# Altium project ACTUALFINALECU.PrjPcb
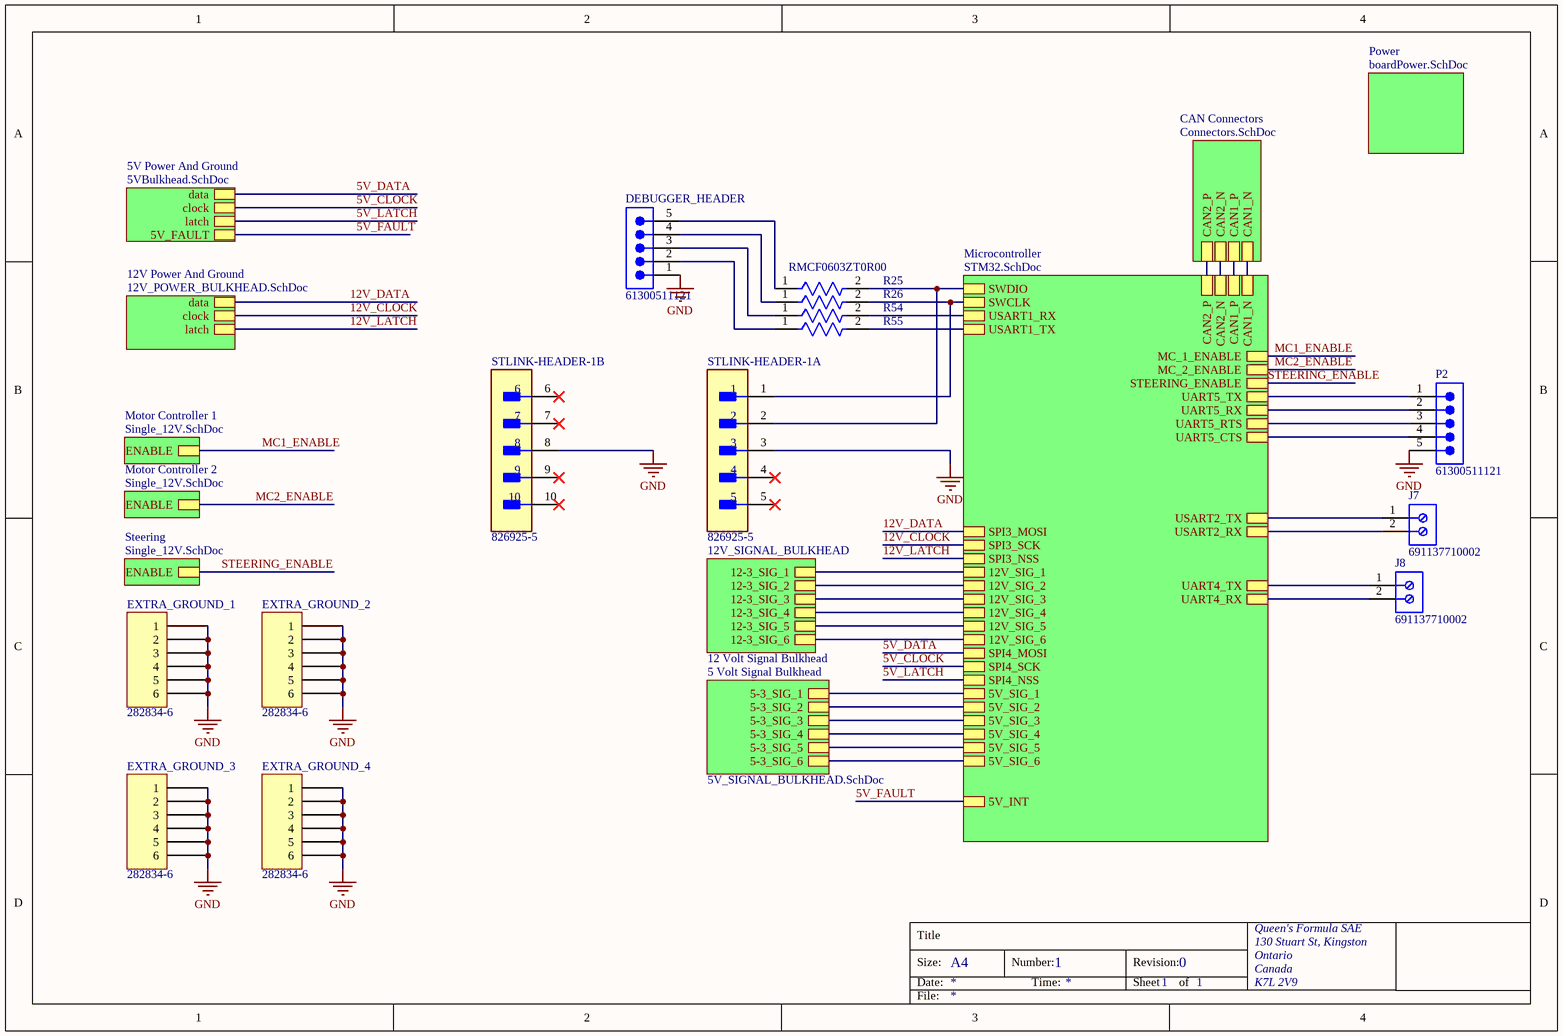
[diagram p0: TOP.SchDoc]
4 sheets, 47 parts. Net scope: hierarchical (ports join the sheet entries above them; power ports are global).
Board file: PCB.PcbDoc
Sheets:
  TOP.SchDoc
    Power = boardPower.SchDoc
    5 Volt Signal Bulkhead = 5V_SIGNAL_BULKHEAD.SchDoc
  CAN.SchDoc

## Sheet TOP.SchDoc: =DocumentName
size A4; Organization: Queen's Formula SAE; Address1: 130 Stuart St, Kingston; Address2: Ontario; Address3: Canada; Address4: K7L 2V9; DocumentNumber: 1; Revision: 0; SheetNumber: 1; SheetTotal: 1

### Parts
DEBUGGER_HEADER  61300511121  [61300511121]
EXTRA_GROUND_1  282834-6  [TE 282834-6]
EXTRA_GROUND_2  282834-6  [TE 282834-6]
EXTRA_GROUND_3  282834-6  [TE 282834-6]
EXTRA_GROUND_4  282834-6  [TE 282834-6]
J7  691137710002  [691137710002]
J8  691137710002  [691137710002]
P2  61300511121  [61300511121]
R25  RMCF0603ZT0R00  [FP-RMCF0603-MFG]
R26  RMCF0603ZT0R00  [FP-RMCF0603-MFG]  (value not drawn)
R54  RMCF0603ZT0R00  [FP-RMCF0603-MFG]  (value not drawn)
R55  RMCF0603ZT0R00  [FP-RMCF0603-MFG]  (value not drawn)
STLINK-HEADER-1  826925-5  [FP-826925-5-MFG]  (parts A,B of 2)

### Sub-sheets
5 Volt Signal Bulkhead = 5V_SIGNAL_BULKHEAD.SchDoc: 5-3_SIG_1, 5-3_SIG_2, 5-3_SIG_3, 5-3_SIG_4, 5-3_SIG_5, 5-3_SIG_6
5V Power And Ground = 5VBulkhead.SchDoc (file not in this document): data, clock, latch, 5V_FAULT
12 Volt Signal Bulkhead = 12V_SIGNAL_BULKHEAD (file not in this document): 12-3_SIG_1, 12-3_SIG_2, 12-3_SIG_3, 12-3_SIG_4, 12-3_SIG_5, 12-3_SIG_6
12V Power And Ground = 12V_POWER_BULKHEAD.SchDoc (file not in this document): data, clock, latch
CAN Connectors = Connectors.SchDoc (file not in this document): CAN1_N, CAN1_P, CAN2_N, CAN2_P
Microcontroller = STM32.SchDoc (file not in this document): SWDIO, SWCLK, USART1_RX, USART1_TX, SPI3_NSS, SPI3_MOSI, SPI3_SCK, CAN1_P, CAN1_N, CAN2_N, CAN2_P, 12V_SIG_1, MC_1_ENABLE, MC_2_ENABLE, STEERING_ENABLE, 12V_SIG_2, 12V_SIG_4, 12V_SIG_3, 12V_SIG_5, 12V_SIG_6, SPI4_NSS, SPI4_MOSI, SPI4_SCK, 5V_SIG_1, 5V_SIG_2, 5V_SIG_3, 5V_SIG_5, 5V_SIG_4, 5V_SIG_6, UART5_TX, UART5_RX, UART5_RTS, UART5_CTS, 5V_INT, USART2_TX, USART2_RX, UART4_TX, UART4_RX
Motor Controller 1 = Single_12V.SchDoc (file not in this document): ENABLE
Motor Controller 2 = Single_12V.SchDoc (file not in this document): ENABLE
Power = boardPower.SchDoc: no entries
Steering = Single_12V.SchDoc (file not in this document): ENABLE

### Nets
GND: DEBUGGER_HEADER.1 EXTRA_GROUND_1.1 EXTRA_GROUND_1.2 EXTRA_GROUND_1.3 EXTRA_GROUND_1.4 EXTRA_GROUND_1.5 EXTRA_GROUND_1.6 EXTRA_GROUND_2.1 EXTRA_GROUND_2.2 EXTRA_GROUND_2.3 EXTRA_GROUND_2.4 EXTRA_GROUND_2.5 EXTRA_GROUND_2.6 EXTRA_GROUND_3.1 EXTRA_GROUND_3.2 EXTRA_GROUND_3.3 EXTRA_GROUND_3.4 EXTRA_GROUND_3.5 EXTRA_GROUND_3.6 EXTRA_GROUND_4.1 EXTRA_GROUND_4.2 EXTRA_GROUND_4.3 EXTRA_GROUND_4.4 EXTRA_GROUND_4.5 EXTRA_GROUND_4.6 P2.5 STLINK-HEADER-1.3 STLINK-HEADER-1.8
5V_CLOCK: sheet Microcontroller/SPI4_SCK, sheet 5V Power And Ground/clock
5V_DATA: sheet Microcontroller/SPI4_MOSI, sheet 5V Power And Ground/data
5V_FAULT: sheet Microcontroller/5V_INT, sheet 5V Power And Ground/5V_FAULT
5V_LATCH: sheet Microcontroller/SPI4_NSS, sheet 5V Power And Ground/latch
12V_CLOCK: sheet Microcontroller/SPI3_SCK, sheet 12V Power And Ground/clock
12V_DATA: sheet Microcontroller/SPI3_MOSI, sheet 12V Power And Ground/data
12V_LATCH: sheet Microcontroller/SPI3_NSS, sheet 12V Power And Ground/latch
MC1_ENABLE: sheet Microcontroller/MC_1_ENABLE, sheet Motor Controller 1/ENABLE
MC2_ENABLE: sheet Microcontroller/MC_2_ENABLE, sheet Motor Controller 2/ENABLE
STEERING_ENABLE: sheet Microcontroller/STEERING_ENABLE, sheet Steering/ENABLE
NetDEBUGGER_HEADER_2: DEBUGGER_HEADER.2 R55.1
NetDEBUGGER_HEADER_3: DEBUGGER_HEADER.3 R54.1
NetDEBUGGER_HEADER_4: DEBUGGER_HEADER.4 R26.1
NetDEBUGGER_HEADER_5: DEBUGGER_HEADER.5 R25.1
NetJ7_1: J7.1 ; sheet Microcontroller/USART2_TX
NetJ7_2: J7.2 ; sheet Microcontroller/USART2_RX
NetJ8_1: J8.1 ; sheet Microcontroller/UART4_TX
NetJ8_2: J8.2 ; sheet Microcontroller/UART4_RX
NetP2_1: P2.1 ; sheet Microcontroller/UART5_TX
NetP2_2: P2.2 ; sheet Microcontroller/UART5_RX
NetP2_3: P2.3 ; sheet Microcontroller/UART5_RTS
NetP2_4: P2.4 ; sheet Microcontroller/UART5_CTS
NetR25_2: R25.2 STLINK-HEADER-1.2 ; sheet Microcontroller/SWDIO
NetR26_2: R26.2 STLINK-HEADER-1.1 ; sheet Microcontroller/SWCLK
NetR54_2: R54.2 ; sheet Microcontroller/USART1_RX
NetR55_2: R55.2 ; sheet Microcontroller/USART1_TX
(unnamed): sheet Microcontroller/CAN1_P, sheet CAN Connectors/CAN1_P
(unnamed): sheet Microcontroller/CAN1_N, sheet CAN Connectors/CAN1_N
(unnamed): sheet Microcontroller/CAN2_N, sheet CAN Connectors/CAN2_N
(unnamed): sheet Microcontroller/CAN2_P, sheet CAN Connectors/CAN2_P
(unnamed): sheet Microcontroller/12V_SIG_1, sheet 12 Volt Signal Bulkhead/12-3_SIG_1
(unnamed): sheet Microcontroller/12V_SIG_2, sheet 12 Volt Signal Bulkhead/12-3_SIG_2
(unnamed): sheet Microcontroller/12V_SIG_4, sheet 12 Volt Signal Bulkhead/12-3_SIG_4
(unnamed): sheet Microcontroller/12V_SIG_3, sheet 12 Volt Signal Bulkhead/12-3_SIG_3
(unnamed): sheet Microcontroller/12V_SIG_5, sheet 12 Volt Signal Bulkhead/12-3_SIG_5
(unnamed): sheet Microcontroller/12V_SIG_6, sheet 12 Volt Signal Bulkhead/12-3_SIG_6
(unnamed): sheet Microcontroller/5V_SIG_1, sheet 5 Volt Signal Bulkhead/5-3_SIG_1
(unnamed): sheet Microcontroller/5V_SIG_2, sheet 5 Volt Signal Bulkhead/5-3_SIG_2
(unnamed): sheet Microcontroller/5V_SIG_3, sheet 5 Volt Signal Bulkhead/5-3_SIG_3
(unnamed): sheet Microcontroller/5V_SIG_5, sheet 5 Volt Signal Bulkhead/5-3_SIG_5
(unnamed): sheet Microcontroller/5V_SIG_4, sheet 5 Volt Signal Bulkhead/5-3_SIG_4
(unnamed): sheet Microcontroller/5V_SIG_6, sheet 5 Volt Signal Bulkhead/5-3_SIG_6

Not connected (* = marked no-connect by the designer): STLINK-HEADER-1 4* 5* 6* 7* 9* 10*

### Notes on the sheet
- Title
- Size:
- Date:
- A4
- Number:
- Time:
- Revision:
- Sheet
- of
- File:

### Library data of the parts
DEBUGGER_HEADER P2 = CMP-1502-01068-2: NexarPartId: 32855526; Operating Supply Voltage: 250V; Number of Contacts: 5; Connector Type: Male Pin; Current Rating: 3A; Contact Resistance: 20mΩ; Pitch: 2.54mm; Gender: Male; Termination: Solder; RoHS: Compliant; Lead Pitch: 2.54mm; Contact Mating Length: 5.9944mm; Number of Positions: 5; Lead Free: Lead Free; Contact Plating: Gold; Number of Pins: 5; Min Operating Temperature: -40°C; Voltage Rating: 250V; Color: Black; Mount: Through Hole; REACH SVHC: Unknown; Packaging: Bulk; Height: 8.89mm; Number of Rows: 1; Orientation: Vertical; Contact Material: Copper; Max Operating Temperature: 105°C
EXTRA_GROUND_1-EXTRA_GROUND_4 = 282834-6: TERM BLK 6P SIDE ENT 2.54MM PCB; Manufacturer: TE Connectivity AMP Connectors; Current: 10A; Mating Orientation: Horizontal with Board; Number of Levels: 1; Pitch: 0.100" (2.54mm); Positions Per Level: 6; Voltage: 150V; Wire Gauge: 16-30 AWG; Wire Termination: Screw - Rising Cage Clamp; Part Number: 282834-6; Color: Green; ComponentLink1Description: Datasheet; ComponentLink1URL: https://www.te.com/commerce/DocumentDelivery/DDEController?Action=srchrtrv&DocNm=282834&DocType=Customer+Drawing&DocLang=English; ComponentLink2Description: DigiKey Link; ComponentLink2URL: http://digikey.com/product-detail/en/te-connectivity-amp-connectors/282834-6/A98337-ND/1153267; LastUpdated: 2020-01-15 4:16:31 AM; Lifecycle Status: Active; Minimum Order: 1; Mounting Type: Through Hole; Packaging: Bulk; Part Status: Active; Price: 4.72; Series: Buchanan; Supplier 1: DigiKey; Supplier Part Number 1: A98337-ND
J7 J8 = CMP-1502-03324-2: NexarPartId: 78871135; Voltage Rating: 300V; Number of Contacts: 2; Current Rating: 16A; Lead Pitch: 5mm; Height: 11.6mm; Packaging: Box; RoHS: Non-Compliant; Contact Material: Nickel, Tin; Max Operating Temperature: 120°C; Number of Pins: 2; Min Operating Temperature: -30°C; Number of Rows: 1
R25 R26 R54 R55 = CMP-26527-000011-1: RES 0 OHM JUMPER 1/10W 0603; Manufacturer: Stackpole; Power Rating: 0.1W; Voltage Rating: 75V; Resistance: 0mΩ; Automotive Grade: Grade 0; Value: 0mΩ; Series: RMCF; Manufacturer Part Number: RMCF0603ZT0R00; Device Class L1: Passive Components; Device Class L3: Chip SMD Resistors; Octopart: https://octopart.com/rmcf0603zt0r00-stackpole+electronics-19213618; Temperature: -55°C to +155°C; Lead Free: Yes; ComponentLink2URL: https://www.seielect.com/catalog/sei-rmcf_rmcp.pdf; Height: 0.55mm; Composition: Thick Film; Package: RMCF0603; Automotive: Yes; Temperature Range High: +155°C; Ipc Land Pattern Name: RESC15580X45; Digikey Description: RES 0 OHM JUMPER 1/10W 0603; RoHS: TRUE; ComponentLink2Description: Datasheet; Temperature Range Low: -55°C; Category: Res; Device Class L2: Resistors
STLINK-HEADER-1 = CMP-03369-000006-1: CONN HEADER VERT 10POS 2.54MM; Manufacturer: TE Connectivity; Conn Orientation: Vertical; Standoff Height: 0.3mm; Number Of Contacts: 10; Current Rating: 5A; Conn Gender: Male; Number Of Rows: 2; Category: Conn; Octopart: https://octopart.com/826925-5-te+connectivity-41836231; Lead Free: Yes; Height: 9.9mm; ComponentLink2Description: Datasheet; Temperature Range High: +105°C; Pitch: 2.54mm; Manufacturer Part Number: 826925-5; Automotive: No; Digikey Description: CONN HEADER VERT 10POS 2.54MM; ComponentLink2URL: https://www.te.com/commerce/DocumentDelivery/DDEController?Action=showdoc&DocId=Customer+Drawing%7F826629%7FAC%7Fpdf%7FEnglish%7FENG_CD_826629_AC.pdf%7F826925-5; Temperature: -65°C to +105°C; RoHS: TRUE; Package: 826925-5; Contact Material: Tin,Nickel; Mouser Description: Headers & Wire Housings 2X05 POS VERT TIN; Device Class L2: Headers and Wire Housings; Device Class L3: unset; Device Class L1: Connectors; Temperature Range Low: -65°C

## Sheet boardPower.SchDoc
size A4
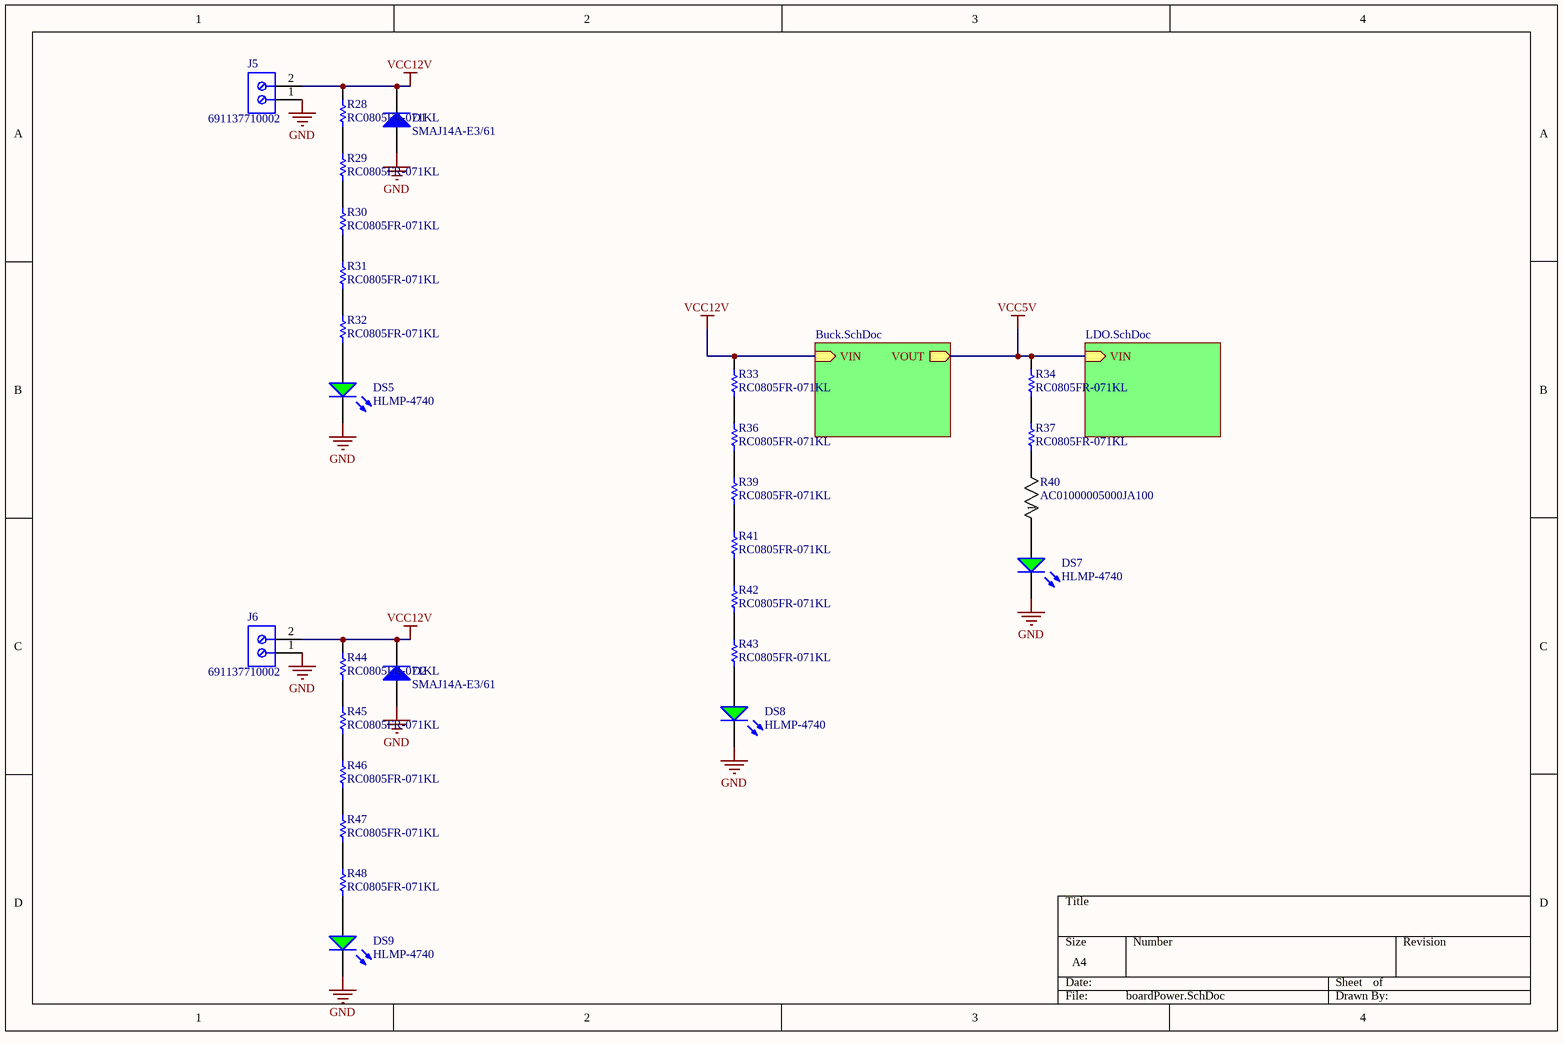
[diagram p1: boardPower.SchDoc]

### Parts
D1  SMAJ14A-E3/61  [VISH-DO-214AC-2_L]
D2  SMAJ14A-E3/61  [VISH-DO-214AC-2_L]
DS5  HLMP-4740  [AVAG-HLMP-4740]
DS7  HLMP-4740  [AVAG-HLMP-4740]
DS8  HLMP-4740  [AVAG-HLMP-4740]
DS9  HLMP-4740  [AVAG-HLMP-4740]
J5  691137710002  [691137710002]
J6  691137710002  [691137710002]
R28  RC0805FR-071KL  [RESC2013X60X35ML10T20]
R29  RC0805FR-071KL  [RESC2013X60X35ML10T20]
R30  RC0805FR-071KL  [RESC2013X60X35ML10T20]
R31  RC0805FR-071KL  [RESC2013X60X35ML10T20]
R32  RC0805FR-071KL  [RESC2013X60X35ML10T20]
R33  RC0805FR-071KL  [RESC2013X60X35ML10T20]
R34  RC0805FR-071KL  [RESC2013X60X35ML10T20]
R36  RC0805FR-071KL  [RESC2013X60X35ML10T20]
R37  RC0805FR-071KL  [RESC2013X60X35ML10T20]
R39  RC0805FR-071KL  [RESC2013X60X35ML10T20]
R40  AC01000005000JA100  [RES_AC01_VIS]
R41  RC0805FR-071KL  [RESC2013X60X35ML10T20]
R42  RC0805FR-071KL  [RESC2013X60X35ML10T20]
R43  RC0805FR-071KL  [RESC2013X60X35ML10T20]
R44  RC0805FR-071KL  [RESC2013X60X35ML10T20]
R45  RC0805FR-071KL  [RESC2013X60X35ML10T20]
R46  RC0805FR-071KL  [RESC2013X60X35ML10T20]
R47  RC0805FR-071KL  [RESC2013X60X35ML10T20]
R48  RC0805FR-071KL  [RESC2013X60X35ML10T20]

### Sub-sheets
Buck = Buck.SchDoc (file not in this document): VIN (in), VOUT (out)
LDO = LDO.SchDoc (file not in this document): VIN (in)

### Nets
GND: D1.2(A) D2.2(A) DS5.2(K) DS7.2(K) DS8.2(K) DS9.2(K) J5.1 J6.1
VCC5V: R34.2 ; sheet Buck/VOUT, sheet LDO/VIN
VCC12V: D1.1(K) D2.1(K) J5.2 J6.2 R28.2 R33.2 R44.2 ; sheet Buck/VIN
NetDS5_1: DS5.1(A) R32.1
NetDS7_1: DS7.1(A) R40.1
NetDS8_1: DS8.1(A) R43.1
NetDS9_1: DS9.1(A) R48.1
NetR28_1: R28.1 R29.2
NetR29_1: R29.1 R30.2
NetR30_1: R30.1 R31.2
NetR31_1: R31.1 R32.2
NetR33_1: R33.1 R36.2
NetR34_1: R34.1 R37.2
NetR36_1: R36.1 R39.2
NetR37_1: R37.1 R40.2
NetR39_1: R39.1 R41.2
NetR41_1: R41.1 R42.2
NetR42_1: R42.1 R43.2
NetR44_1: R44.1 R45.2
NetR45_1: R45.1 R46.2
NetR46_1: R46.1 R47.2
NetR47_1: R47.1 R48.2

### Library data of the parts
D1 D2 = CMP-0548-00224-2: Transient Voltage Suppressor, 6.40 to 231 V, 14 V Stand-off Voltage, Uni-Directional, -55 to 155 degC, 2-pin DO-214AC, Pb-Free, Tape and Reel; Manufacturer: Vishay Semiconductor; PPPM (W): 400, 300; VWM (V): 14; VBR Uni-Directional (V): 6.4 to 231; IFSM: 40 A; ID (uA): 1; PackageDescription: 2-Pin DO-214AC (SMA), Body 4.245 x 2.665 mm; ComponentLink2URL: http://www.vishay.com/docs/88390/smaj50a.pdf; Mounting Technology: Surface Mount; PartNumber: SMAJ14A-E3/61; Operating Junction and Storage Temperature Range: -55 to 150 degC; ComponentLink2Description: Datasheet; Packing: Tape and Reel; PackageReference: DO-214AC-2; ComponentLink3Description: Package Specification; ComponentLink1URL: http://www.vishay.com/; RoHS: TRUE; ComponentLink3URL: http://www.vishay.com/docs/88390/smaj50a.pdf; ComponentLink1Description: Manufacturer URL; DatasheetVersion: 12/8/2013
DS5 DS7-DS9 = CMP-2000-06413-1: T-1 3/4 (5 mm) Low Current LED Lamp, Green, 1.9 V, -20 to 100 degC, 2-Pin THD, RoHS, Bulk; Manufacturer: AvagoTechnologies; Type: Uni-Color; Peak Wavelength: 565nm; Rad Hard: No; Viewing Angle: 50°; Dominant Wavelength/Color Temperature: 569nm; Number of LEDs: 1; Lens Appearance: ColoredDiffused; Lens Shape Type: Circular; Mounting Orientation: TopMount; Intensity: 2.3mcd; Datasheet Version: 07/2014; Category: LEDs; Datasheet URL: http://docs.avagotech.com/docs/AV02-1557EN; Packaging: Bulk; Pin Count: 2; Mounting Technology: ThroughHole; Package Reference: HLMP-4740; Mounting: ThroughHole; Manufacturer URL: http://www.avagotech.com/; Color: Green; Package: 2T-13/4; Package Description: 2-Pin Through Hole Device, Dia 5.845 mm, Pitch 2.54 mm
J5 J6 = CMP-1502-03324-2: as J7 on sheet TOP; Lead Pitch: 5mm; Height: 11.6mm; Packaging: Box; RoHS: Non-Compliant; Contact Material: Nickel, Tin; Max Operating Temperature: 120°C; Number of Pins: 2; Min Operating Temperature: -30°C; Number of Rows: 1
R28-R34 R36 R37 R39 R41-R48 = CMP-2100-03671-1: Chip Resistor, 1 KOhm, +/- 1%, 125 mW, -55 to 155 degC, 0805 (2012 Metric), RoHS, Tape and Reel; Manufacturer: Yageo; Temperature Coefficient: 100ppm/degreesC; Voltage Rating (DC): 150V; Max Power Dissipation: 125mW; Resistance: 1KOhm; Number of Pins: 2; Number of Terminations: 2; Datasheet URL: http://www.yageo.com/NewPortal/yageodocoutput?fileName=/pdf/R-Chip/PYu-RC_Group_51_RoHS_L_5.pdf; Length: 0.079inch; Package Description: 2-Pin Surface Mounted Device, Body 2 x 1.25 mm; Depth: 1.25mm; Height: 0.024inch; Military Standard: Not; Case/Package: 0805; Package Reference: 0805; RoHSCompliant: true; Lead Free: LeadFree; Packaging: TapeandReel; Package Quantity: 1; Datasheet Version: Rev. 5, 10/2016; Tolerance: 1%; Min Operating Temperature: -55degC; Voltage Rating: 150V; Composition: ThickFilm; Case Code (Imperial): 0805; Power Rating: 125mW; Width: 0.049inch; Case Code (Metric): 2012; Manufacturer URL: http://www.yageo.com/; Max Operating Temperature: 155degC; REACH SVHC: Unknown; Termination: SMD/SMT
R40 = CMP-00030-39746512-1: AC01000005000JA100 Res Wirewound 500 Ohm 5% 1W 100ppm/°C to 180ppm/°C Conformal AXL Thru-Hole Ammo Pack; Voltage Rating (DC): 22V; Lead Diameter: 800µm; Resistance: 500Ω; Weight: 519.986953mg; Number of Pins: 2; Min Operating Temperature: -40°C; Case/Package: Axial; Schedule B: 8533210080, 8533210080; Features: Flame Retardant Coating; Power Rating: 1W; Max Power Dissipation: 1W; Packaging: Tape & Box (TB); RoHS: Compliant; REACH SVHC: Unknown; NexarPartId: 39746512; Temperature Coefficient: 180ppm/°C; Diameter: 4.3mm; Contact Plating: Tin; Radiation Hardening: No; Max Operating Temperature: 275°C; Length: 11mm; Tolerance: 5%; Composition: Wirewound; Number of Terminations: 2; Termination: Axial; Voltage Rating: 22V

## Sheet 5V_SIGNAL_BULKHEAD.SchDoc
size A4
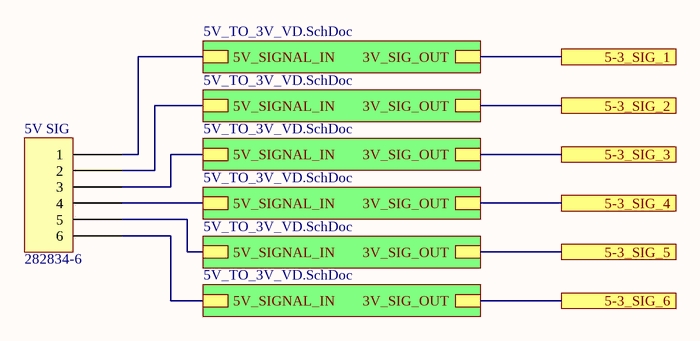
[diagram p2: 5V_SIGNAL_BULKHEAD.SchDoc]

### Parts
5V_SIG  282834-6  [TE 282834-6]

### Sub-sheets
Designator = 5V_TO_3V_VD.SchDoc (file not in this document): 5V_SIGNAL_IN, 3V_SIG_OUT
Designator = 5V_TO_3V_VD.SchDoc (file not in this document): 5V_SIGNAL_IN, 3V_SIG_OUT
Designator = 5V_TO_3V_VD.SchDoc (file not in this document): 5V_SIGNAL_IN, 3V_SIG_OUT
Designator = 5V_TO_3V_VD.SchDoc (file not in this document): 5V_SIGNAL_IN, 3V_SIG_OUT
Designator = 5V_TO_3V_VD.SchDoc (file not in this document): 5V_SIGNAL_IN, 3V_SIG_OUT
Designator = 5V_TO_3V_VD.SchDoc (file not in this document): 5V_SIGNAL_IN, 3V_SIG_OUT

### Ports
5-3_SIG_1, 5-3_SIG_2, 5-3_SIG_3, 5-3_SIG_4, 5-3_SIG_5, 5-3_SIG_6

### Nets
Net5V_SIG_1: 5V_SIG.1 ; sheet Designator/5V_SIGNAL_IN
Net5V_SIG_2: 5V_SIG.2 ; sheet Designator/5V_SIGNAL_IN
Net5V_SIG_3: 5V_SIG.3 ; sheet Designator/5V_SIGNAL_IN
Net5V_SIG_4: 5V_SIG.4 ; sheet Designator/5V_SIGNAL_IN
Net5V_SIG_5: 5V_SIG.5 ; sheet Designator/5V_SIGNAL_IN
Net5V_SIG_6: 5V_SIG.6 ; sheet Designator/5V_SIGNAL_IN
(unnamed): port 5-3_SIG_1, sheet Designator/3V_SIG_OUT
(unnamed): port 5-3_SIG_2, sheet Designator/3V_SIG_OUT
(unnamed): port 5-3_SIG_3, sheet Designator/3V_SIG_OUT
(unnamed): port 5-3_SIG_5, sheet Designator/3V_SIG_OUT
(unnamed): port 5-3_SIG_4, sheet Designator/3V_SIG_OUT
(unnamed): port 5-3_SIG_6, sheet Designator/3V_SIG_OUT

### Library data of the parts
5V_SIG = 282834-6: as EXTRA_GROUND_1 on sheet TOP; Part Number: 282834-6; Color: Green; ComponentLink1Description: Datasheet; ComponentLink1URL: https://www.te.com/commerce/DocumentDelivery/DDEController?Action=srchrtrv&DocNm=282834&DocType=Customer+Drawing&DocLang=English; ComponentLink2Description: DigiKey Link; ComponentLink2URL: http://digikey.com/product-detail/en/te-connectivity-amp-connectors/282834-6/A98337-ND/1153267; LastUpdated: 2020-01-15 4:16:31 AM; Lifecycle Status: Active; Minimum Order: 1; Mounting Type: Through Hole; Packaging: Bulk; Part Status: Active; Price: 4.72; Series: Buchanan; Supplier 1: DigiKey; Supplier Part Number 1: A98337-ND

## Sheet CAN.SchDoc
size A4
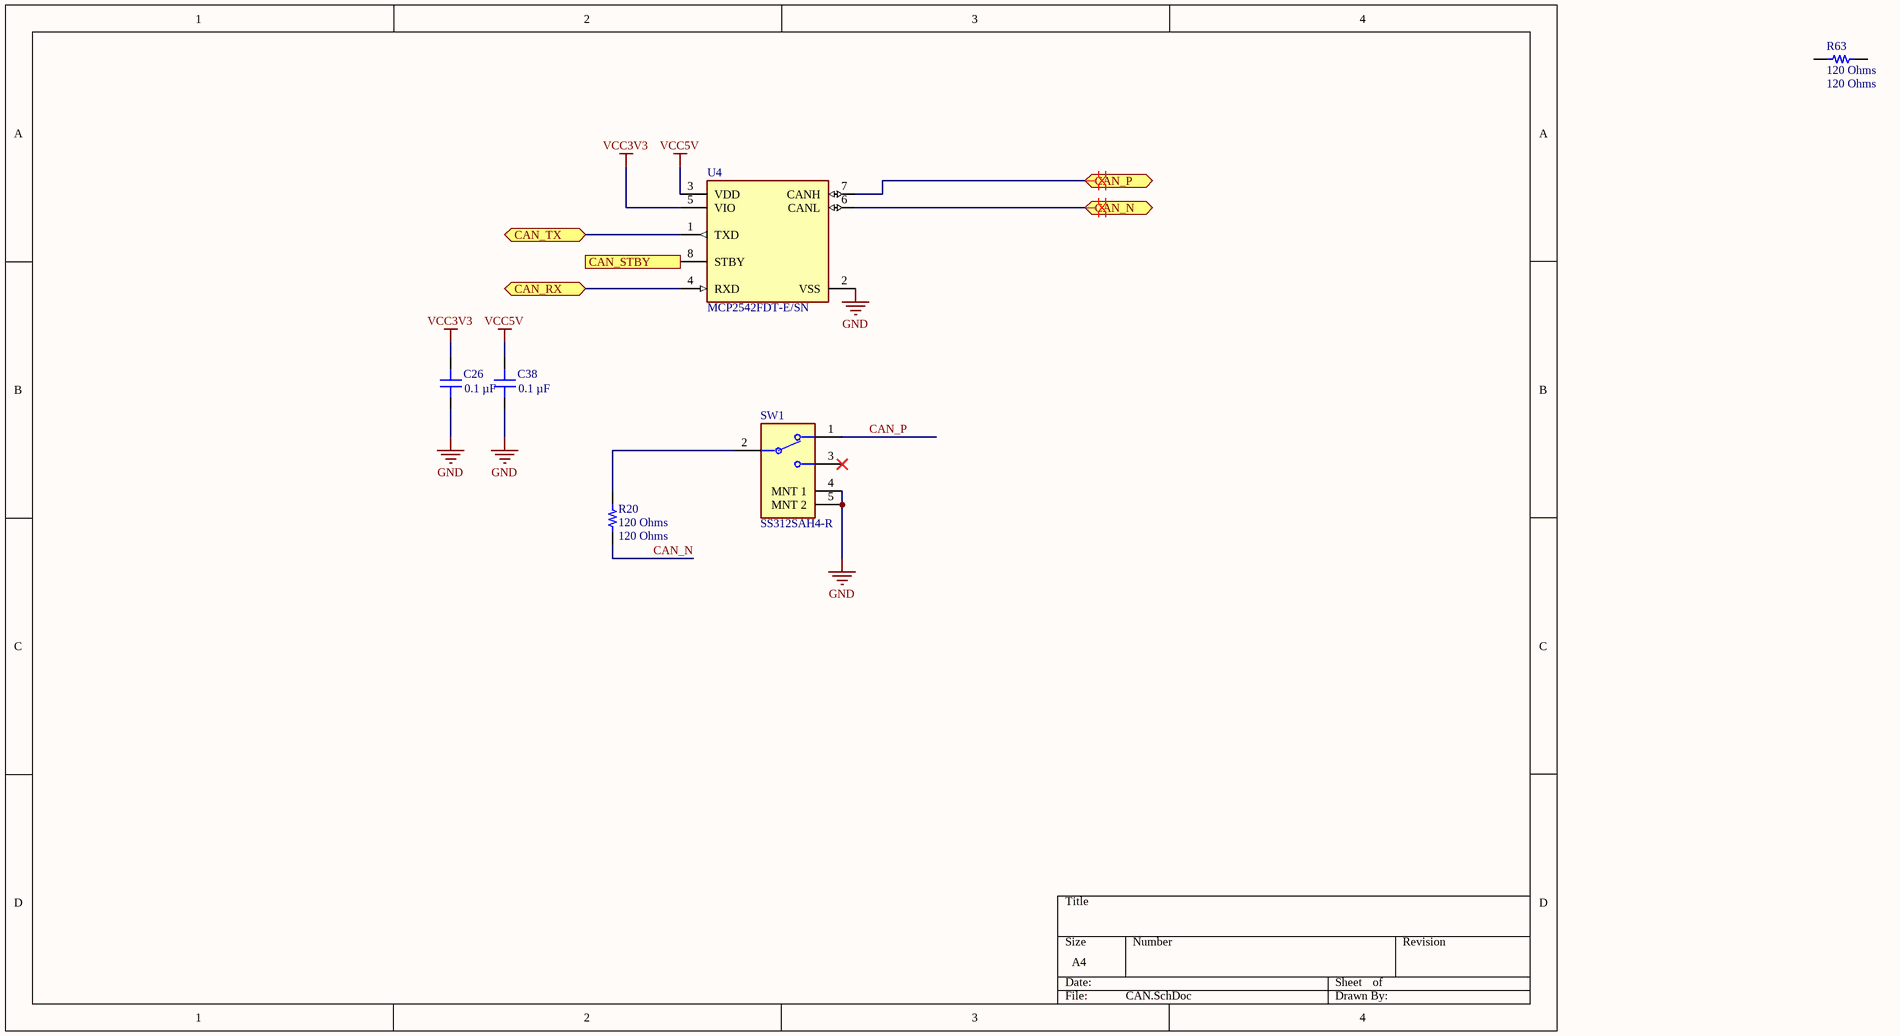
[diagram p3: CAN.SchDoc]

### Parts
C26  0.1 µF  [CAP 0805_2012]
C38  0.1 µF  [CAP 0805_2012]
R20  120 Ohms  [RES 0805_2012]
R63  120 Ohms  [RES 0805_2012]
SW1  SS312SAH4-R  [FP-SS312SAH4-R-MFG]
U4  MCP2542FDT-E/SN  [FP-C04-057-SN-IPC_C]

### Ports
CAN_N (bidir), CAN_P (bidir), CAN_RX (bidir), CAN_STBY (in), CAN_TX (bidir)

### Nets
GND: C26.1 C38.1 SW1.4(MNT_1) SW1.5(MNT_2) U4.2(VSS)
VCC3V3: C26.2 U4.5(VIO)
VCC5V: C38.2 U4.3(VDD)
CAN_N: R20.1
CAN_P: SW1.1
NetR20_2: R20.2 SW1.2(COM)
NetU4_1: U4.1(TXD) ; port CAN_TX
NetU4_4: U4.4(RXD) ; port CAN_RX
NetU4_6: U4.6(CANL) ; port CAN_N
NetU4_7: U4.7(CANH) ; port CAN_P
NetU4_8: U4.8(STBY) ; port CAN_STBY

Not connected (* = marked no-connect by the designer): R63 1 2; SW1 3*

### Layout directives
differential pair: NetU4_6, NetU4_7

### Library data of the parts
C26 C38 = CC0805MRX7R9BB104: CAP CER 0.1UF 50V X7R 0805; manufacturer: Yageo; Tolerance: ±20%; Part Number: CC0805MRX7R9BB104; Value: 0.1 µF; Applications: General Purpose; Capacitance: 0.1 µF; componentlink1description: Datasheet; componentlink1url: https://www.yageo.com/upload/media/product/productsearch/datasheet/mlcc/UPY-GPHC_X7R_6.3V-to-50V_18.pdf; componentlink2description: DigiKey Link; componentlink2url: https://www.digikey.com/en/products/detail/yageo/CC0805MRX7R9BB104/5884281; Device Package: 0805 (2012 Metric); lastupdated: 2023-10-12 7:14:35 PM; Lifecycle Status: Active; Minimum Order: 1; Mounting Type: Surface Mount, MLCC; Operating Temperature: -55°C ~ 125°C; Package / Case: 0805 (2012 Metric); packaging: TapeAndReel; partid: 2475; Part Status: Active; price: 0.01; series: CC; Size / Dimension: 0.079" L x 0.049" W (2.00mm x 1.25mm); Supplier 1: DigiKey; Supplier Part Number 1: 311-4351-1-ND; Temperature Coefficient: X7R; Thickness (Max): 0.037" (0.95mm); Voltage - Rated: 50V
R20 R63 = ERJ-6ENF1200V: RES SMD 120 OHM 1% 1/8W 0805; Part Number: ERJ-6ENF1200V; Value: 120 Ohms
SW1 = CMP-31746-000001-1: SWITCH SLIDE SPDT 0.4VA 28V; Mechanical Life: 10000Cycles; Switch Function: On-On; Actuator Length: 2mm; Contact Style: Shorting; Max Current Rating: 100mA; Actuator Type: Standard; Actuator Material: Polyphenylene; Length: 10.5mm; Orientation: Right Angle; Voltage Rating (DC): 28V; Contact Material: Bronze; Electrical Life: 10000Cycles; Max Operating Temperature: 85°C; Case/Package: SMD/SMT; Depth: 7.45mm; Contact Plating: Gold; Voltage Rating (AC): 28V; Package Quantity: 1; Min Operating Temperature: -25°C; Switch Travel: 2mm; Housing Material: Bronze; RoHS Compliant: Yes; Lead Free: Lead Free; Termination: Gull Wing; Packaging: Tape and Reel; REACH SVHC: No SVHC; Mount: Surface Mount; Series: SS3; Throw Configuration: SPDT; Max Voltage Rating (AC): 28V; Max Voltage Rating (DC): 28V
U4 = CMP-06279-000006-1: IC TRANSCEIVER 1/1 8SOIC; Data Rate: 8Mbps; Receiver Hysteresis: 200mV; Min Operating Temperature: -40°C; Mount: Surface Mount; Case/Package: SOIC; Max Operating Temperature: 125°C; Packaging: Rail/Tube

## Nets that join several sheets
GND: TOP (28 pins), boardPower (8 pins), CAN (5 pins)
VCC5V: boardPower (R34.2), CAN (C38.2 U4.3)